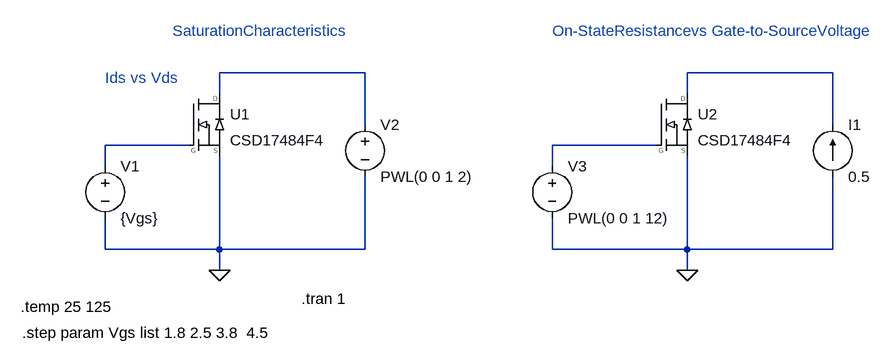
[diagram p0: schematic CSD17484F4-jig.asc]
CSD17484F4-jig.asc, the LTspice schematic file:
Version 4
SHEET 1 1228 680
WIRE 416 80 192 80
WIRE 1136 80 912 80
WIRE 192 112 192 80
WIRE 912 112 912 80
WIRE 416 160 416 80
WIRE 1136 160 1136 80
WIRE 144 192 16 192
WIRE 864 192 704 192
WIRE 16 224 16 192
WIRE 704 224 704 192
WIRE 16 352 16 304
WIRE 192 352 192 208
WIRE 192 352 16 352
WIRE 416 352 416 240
WIRE 416 352 192 352
WIRE 704 352 704 304
WIRE 912 352 912 208
WIRE 912 352 704 352
WIRE 1136 352 1136 240
WIRE 1136 352 912 352
WIRE 192 384 192 352
WIRE 912 384 912 352
FLAG 192 384 0
FLAG 912 384 0
SYMBOL _PERSONAL\\nmos\\Texas\\CSD17484F4 144 112 R0
SYMATTR InstName U1
SYMBOL voltage 16 208 R0
WINDOW 123 0 0 Left 0
WINDOW 39 0 0 Left 0
SYMATTR InstName V1
SYMATTR Value {Vgs}
SYMBOL voltage 416 144 R0
WINDOW 123 0 0 Left 0
WINDOW 39 0 0 Left 0
SYMATTR InstName V2
SYMATTR Value PWL(0 0 1 2)
SYMBOL _PERSONAL\\nmos\\Texas\\CSD17484F4 864 112 R0
SYMATTR InstName U2
SYMBOL current 1136 240 M180
WINDOW 0 24 80 Left 2
WINDOW 3 24 0 Left 2
WINDOW 123 0 0 Left 0
WINDOW 39 0 0 Left 0
SYMATTR InstName I1
SYMATTR Value 0.5
SYMBOL voltage 704 208 R0
WINDOW 123 0 0 Left 0
WINDOW 39 0 0 Left 0
SYMATTR InstName V3
SYMATTR Value PWL(0 0 1 12)
TEXT -114 440 Left 2 !.temp 25 125
TEXT -112 480 Left 2 !.step param Vgs list 1.8 2.5 3.8  4.5
TEXT 16 88 Left 2 ;Ids vs Vds
TEXT 318 428 Left 2 !.tran 1
TEXT 704 16 Left 2 ;On-StateResistancevs Gate-to-SourceVoltage
TEXT 120 16 Left 2 ;SaturationCharacteristics

The netlist it stands for:
* CSD17484F4-jig.asc
XU1 N001 N003 0 CSD17484F4 CSD17484F4 CSD17484F4  ; pins D G S
V1 N003 0 {Vgs}
V2 N001 0 PWL(0 0 1 2)
XU2 N002 N004 0 CSD17484F4 CSD17484F4 CSD17484F4  ; pins D G S
I1 0 N002 0.5
V3 N004 0 PWL(0 0 1 12)
.temp 25 125
.step param Vgs list 1.8 2.5 3.8  4.5
* Ids vs Vds
.tran 1
* On-StateResistancevs Gate-to-SourceVoltage
* SaturationCharacteristics
.lib ../sym/_PERSONAL/nmos/Texas/CSD17484F4.lib
.backanno
.end